# Altium schematic sheet LCD Breakout (4DLCD-43480272).SchDoc
size A
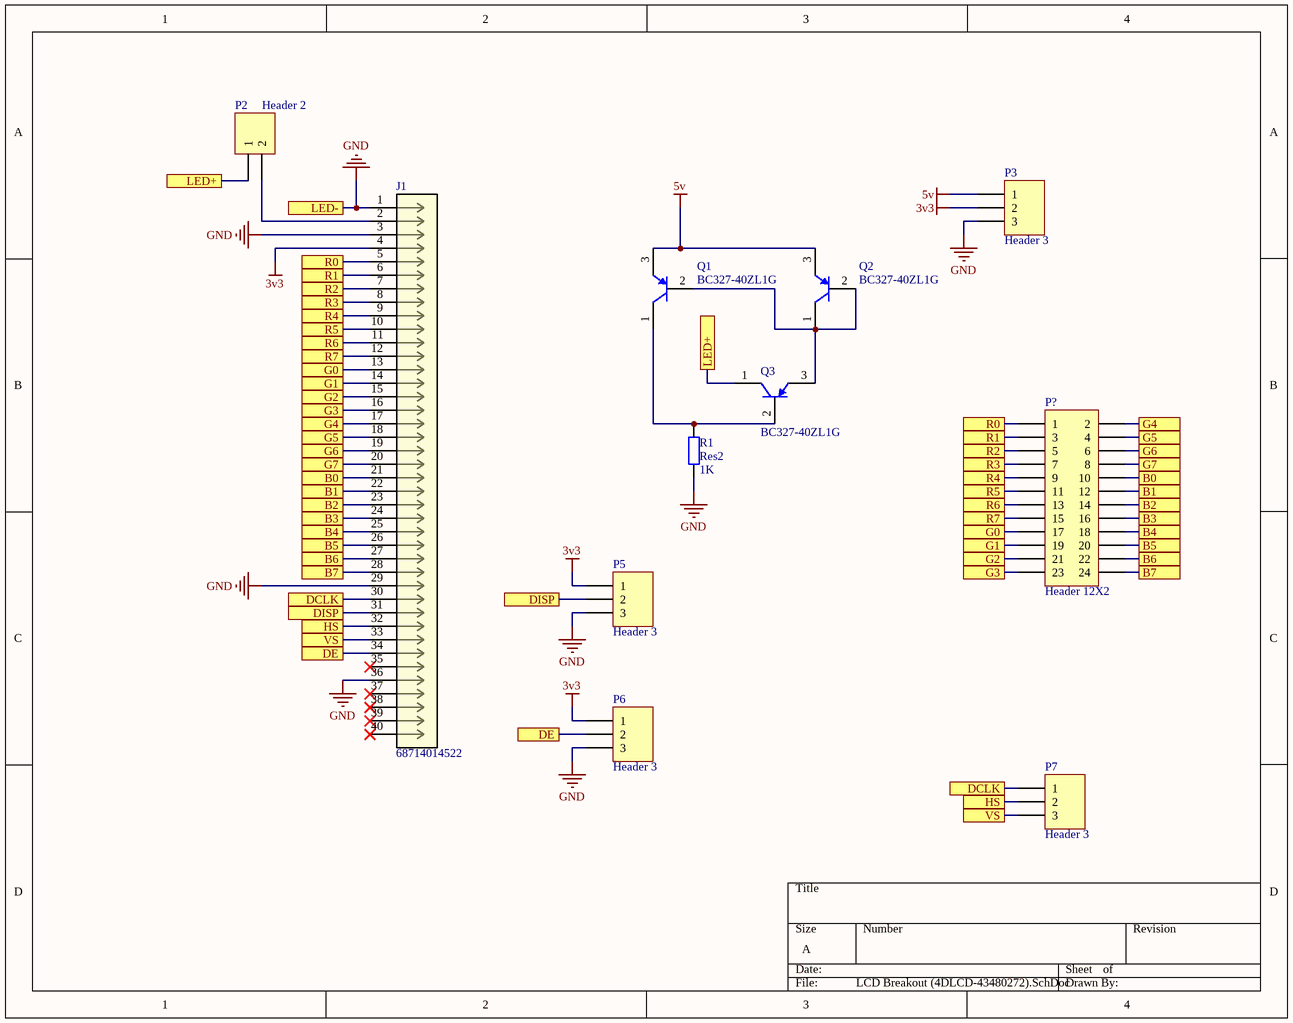
[diagram p0: LCD Breakout (4DLCD-43480272).SchDoc]

## Parts
J1  68714014522  [CONN40_014522_WRE]
P2  Header 2  [HDR1X2]
P3  Header 3  [HDR1X3]
P5  Header 3  [HDR1X3]
P6  Header 3  [HDR1X3]
P7  Header 3  [HDR1X3]
P?  Header 12X2  [HDR2X12]
Q1  BC327-40ZL1G  [ONSC-TO-92-3-29-11_AM_BL]
Q2  BC327-40ZL1G  [ONSC-TO-92-3-29-11_AM_BL]
Q3  BC327-40ZL1G  [ONSC-TO-92-3-29-11_AM_BL]
R1  Res2  value 1K  [AXIAL-0.4]

## Ports
B0, B1, B2, B3, B4, B5, B6, B7, DCLK, DE, DISP, G0, G1, G2, G3, G4, G5, G6, G7, HS, LED+, LED-, R0, R1, R2, R3, R4, R5, R6, R7, VS

## Nets
3v3: J1.4 P3.2 P5.1 P6.1
5v: P3.1 Q1.3(E) Q2.3(E)
GND: J1.1 J1.3 J1.29 J1.36 P3.3 P5.3 P6.3 R1.1 ; port LED-
B0: J1.21 P?.10 ; port B0
B1: J1.22 P?.12 ; port B1
B2: J1.23 P?.14 ; port B2
B3: J1.24 P?.16 ; port B3
B4: J1.25 P?.18 ; port B4
B5: J1.26 P?.20 ; port B5
B6: J1.27 P?.22 ; port B6
B7: J1.28 P?.24 ; port B7
DCLK: J1.30 P7.1 ; port DCLK
DE: J1.34 P6.2 ; port DE
DISP: J1.31 P5.2 ; port DISP
G0: J1.13 P?.17 ; port G0
G1: J1.14 P?.19 ; port G1
G2: J1.15 P?.21 ; port G2
G3: J1.16 P?.23 ; port G3
G4: J1.17 P?.2 ; port G4
G5: J1.18 P?.4 ; port G5
G6: J1.19 P?.6 ; port G6
G7: J1.20 P?.8 ; port G7
HS: J1.32 P7.2 ; port HS
LED+: P2.1 Q3.1(C) ; port LED+
R0: J1.5 P?.1 ; port R0
R1: J1.6 P?.3 ; port R1
R2: J1.7 P?.5 ; port R2
R3: J1.8 P?.7 ; port R3
R4: J1.9 P?.9 ; port R4
R5: J1.10 P?.11 ; port R5
R6: J1.11 P?.13 ; port R6
R7: J1.12 P?.15 ; port R7
VS: J1.33 P7.3 ; port VS
NetJ1_2: J1.2 P2.2
NetQ1_1: Q1.1(C) Q3.2(B) R1.2
NetQ1_2: Q1.2(B) Q2.1(C) Q2.2(B) Q3.3(E)

Not connected (* = marked no-connect by the designer): J1 35* 37* 38* 39* 40*

## Library data of the parts
J1 = 68714014522: No Description Available; Built_By: EMA_Matt; Vendor: Wurth Electronics; SourceLibrary: Add_to_database_2020-11-03; Datasheet: https://www.we-online.de/katalog/datasheet/6871xx14522.pdf; Copyright: Copyright (C) 2018 Accelerated Designs. All rights reserved; Manufacturer_Part_Number: 68714014522; RefDes: RefDes; Type: DEV
P2 = Header 2: Header, 2-Pin; LatestRevisionDate: 17-Jul-2002; LatestRevisionNote: Re-released for DXP Platform.; Publisher: Altium Limited
P3 P5-P7 = Header 3: Header, 3-Pin; LatestRevisionDate: 17-Jul-2002; LatestRevisionNote: Re-released for DXP Platform.; Publisher: Altium Limited
P? = Header 12X2: Header, 12-Pin, Dual row; LatestRevisionDate: 17-Jul-2002; LatestRevisionNote: Re-released for DXP Platform.; Publisher: Altium Limited
Q1-Q3 = CMP-1048-01589-1: Amplifier Transistor, PNP Silicon, 3-Pin TO-92, Pb-Free, Ammo Box; Manufacturer: On Semiconductor; IC Continuous (A): -0.8; ComponentLink2Description: Datasheet; ComponentLink1URL: http://www.onsemi.com/; Packing: Ammo Box; ComponentLink3Description: Package Specification; DatasheetVersion: Rev. 6; PartNumber: BC327-40ZL1G; PackageDescription: 3-Pin Transistor Outline, Body 4.825 x 3.685 mm, Pitch 1.27 mm; RoHS: TRUE; PackageReference: TO-92-3-29-11_AM_BL; Mounting Technology: Through Hole; ComponentLink1Description: Manufacturer URL; ComponentLink3URL: http://www.onsemi.com/pub_link/Collateral/MAC97-D.PDF; Polarity: PNP; PackageVersion: Rev. AM; ComponentLink2URL: http://www.onsemi.com/pub_link/Collateral/BC327-D.PDF
R1 = Res2: Resistor; Published: 8-Jun-2000; LatestRevisionDate: 17-Jul-2002; LatestRevisionNote: Re-released for DXP Platform.; PackageReference: AXIAL-0.4; Publisher: Altium Limited; PackageDescription: Axial Device, Thru-Hole; 2 Leads; 0.4 in Pin Spacing